# EAGLE design tardis-r2 (EAGLE 9.4.2)

## Sheet 1 of 3
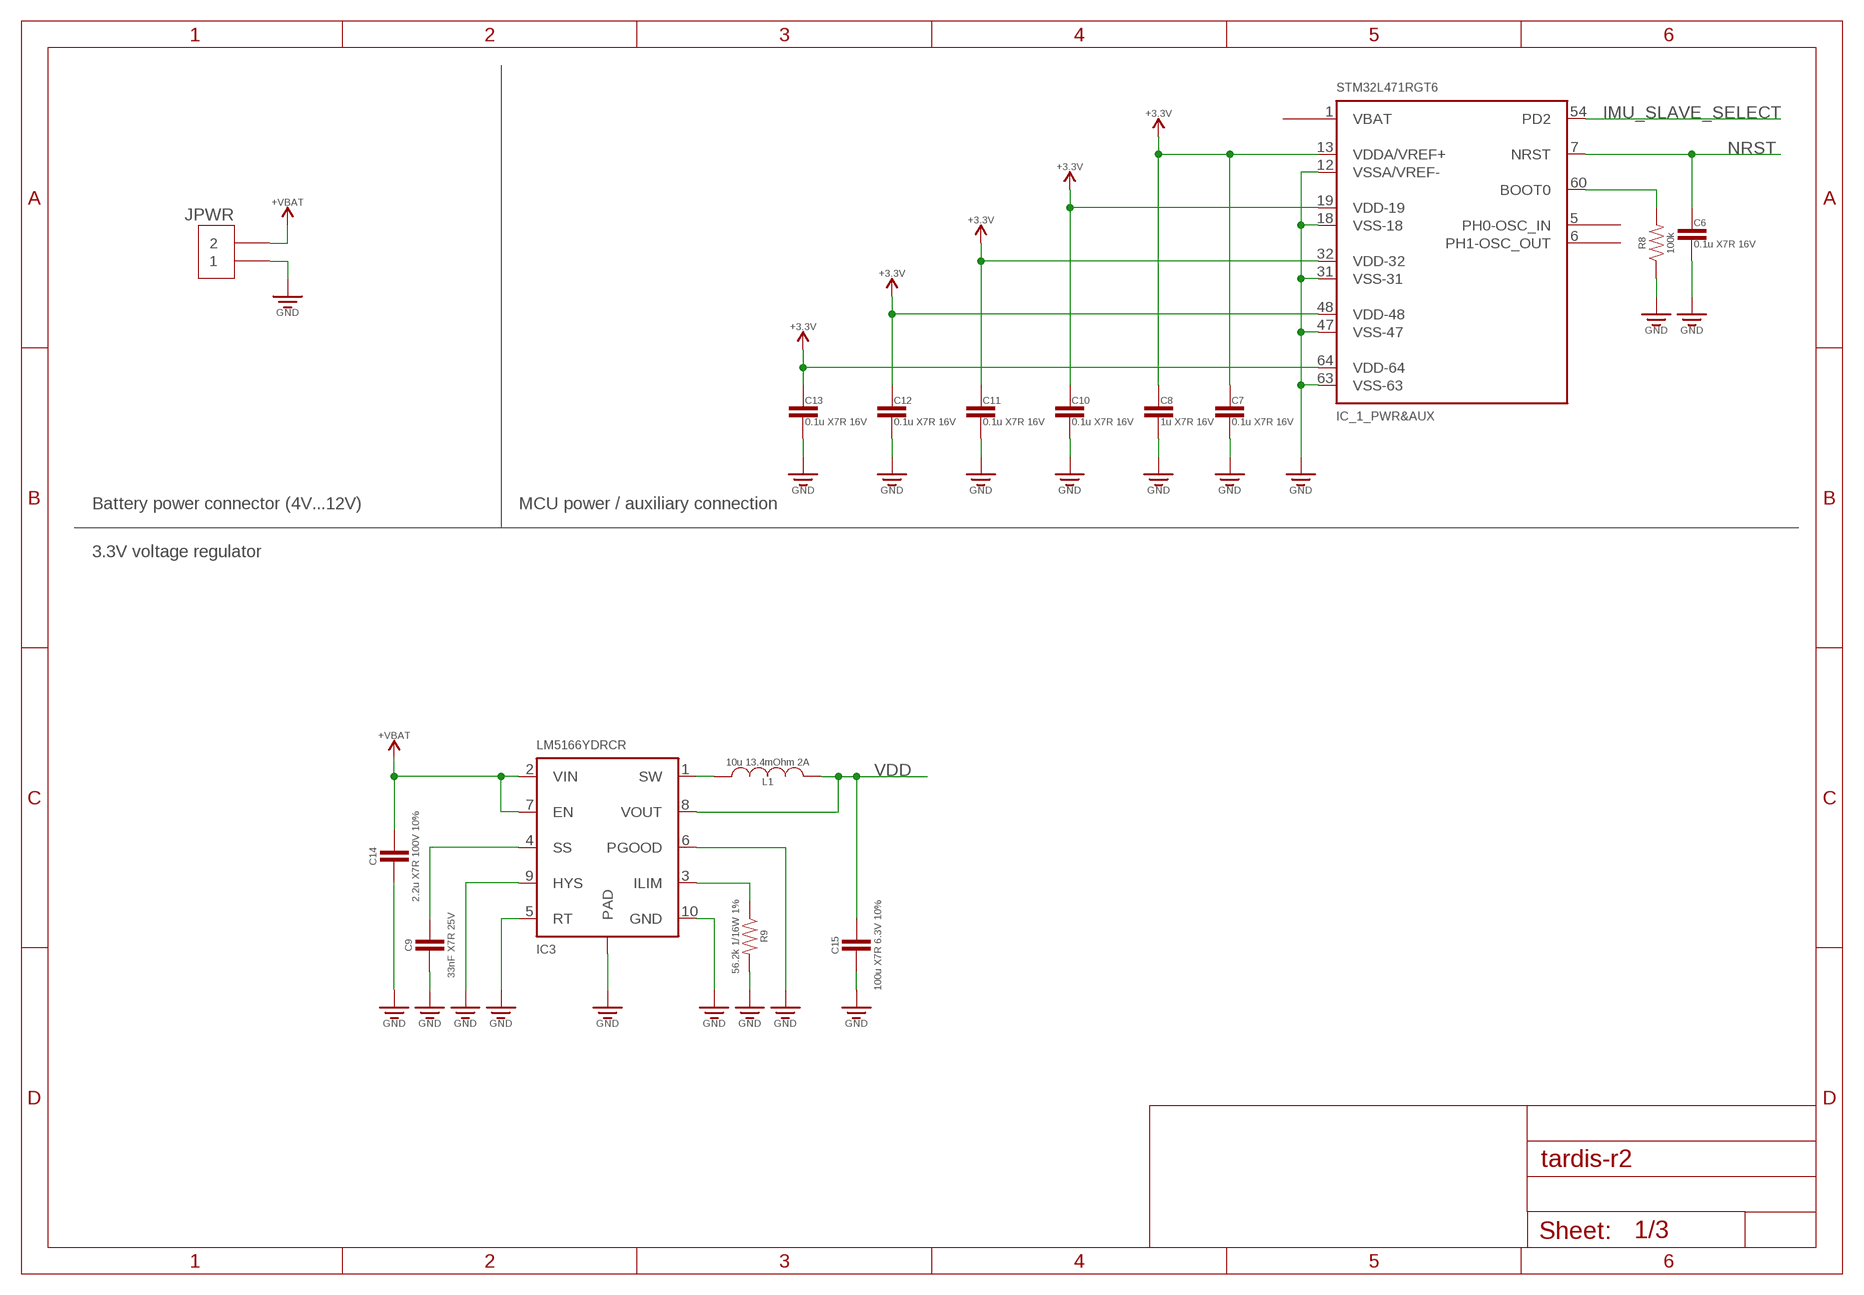
[diagram p0: schematic, sheet 1]

### Parts
C6  0.1u X7R 16V  CAPACITOR0603  [CAPACITOR-0603]
C7  0.1u X7R 16V  CAPACITOR0603  [CAPACITOR-0603]
C8  1u X7R 16V  CAPACITOR0603  [CAPACITOR-0603]
C9  33nF X7R 25V  CAPACITOR0402  [CAPACITOR-0402]
C10  0.1u X7R 16V  CAPACITOR0603  [CAPACITOR-0603]
C11  0.1u X7R 16V  CAPACITOR0603  [CAPACITOR-0603]
C12  0.1u X7R 16V  CAPACITOR0603  [CAPACITOR-0603]
C13  0.1u X7R 16V  CAPACITOR0603  [CAPACITOR-0603]
C14  2.2u X7R 100V 10%  CAPACITOR1206  [CAPACITOR-1206]
C15  100u X7R 6.3V 10%  CAPACITOR1206  [CAPACITOR-1206]
IC3  LM5166YDRCR  [VSON-10-0.5MM-PAD]
IC_1  STM32L471RGT6  [LQFP64_10X10]
JPWR  WURTH_691103110002  [WURTH_691103110002]
L1  10u 13.4mOhm 2A  INDUCTORWE-74477710  [INDUCTOR-WE-74477710]
R8  100k  RESISTOR0603  [RESISTOR-0603]
R9  56.2k 1/16W 1%  RESISTOR0402  [RESISTOR-0402]
SUPPLY9  +VBAT  (no package)
SUPPLY10  +3.3V  (no package)
SUPPLY11  +3.3V  (no package)
SUPPLY12  +3.3V  (no package)
SUPPLY13  +3.3V  (no package)
SUPPLY14  +3.3V  (no package)
SUPPLY15  +VBAT  (no package)
U$3  NC  (no package)
U$4  NC  (no package)
U$5  NC  (no package)

### Nets
BOOT0: IC_1.60(_PWR&AUX:BOOT0) R8.P$2
GND: C6.2 C7.2 C8.2 C9.P$2 C10.2 C11.2 C12.2 C13.2 C14.P$2 C15.P$2 IC3.5(RT) IC3.6(PGOOD) IC3.9(HYS) IC3.10(GND) IC3.PAD IC_1.12(_PWR&AUX:VSSA/VREF-) IC_1.18(_PWR&AUX:VSS-18) IC_1.31(_PWR&AUX:VSS-31) IC_1.47(_PWR&AUX:VSS-47) IC_1.63(_PWR&AUX:VSS-63) JPWR.1 R8.P$1 R9.P$2 ; also sheet 2
ILIM: IC3.3(ILIM) R9.P$1
IMU_SLAVE_SELECT: IC_1.54(_PWR&AUX:PD2) ; also sheet 2
NRST: C6.1 IC_1.7(_PWR&AUX:NRST) ; also sheet 2
SS: C9.P$1 IC3.4(SS)
SW: IC3.1(SW) L1.P$1
VBAT: C14.P$1 IC3.2(VIN) IC3.7(EN) JPWR.2 SUPPLY9.VCC SUPPLY15.VCC
VDD: C7.1 C8.1 C10.1 C11.1 C12.1 C13.1 C15.P$1 IC3.8(VOUT) IC_1.13(_PWR&AUX:VDDA/VREF+) IC_1.19(_PWR&AUX:VDD-19) IC_1.32(_PWR&AUX:VDD-32) IC_1.48(_PWR&AUX:VDD-48) IC_1.64(_PWR&AUX:VDD-64) L1.P$2 SUPPLY10.VCC SUPPLY11.VCC SUPPLY12.VCC SUPPLY13.VCC SUPPLY14.VCC ; also sheet 2
Unconnected: IC_1.1(_PWR&AUX:VBAT) IC_1.5(_PWR&AUX:PH0-OSC_IN) IC_1.6(_PWR&AUX:PH1-OSC_OUT) U$3.1 U$4.1 U$5.1

### Notes on the sheet
- Battery power connector (4V...12V) | MCU power / auxiliary connection
- 3.3V voltage regulator

## Sheet 2 of 3
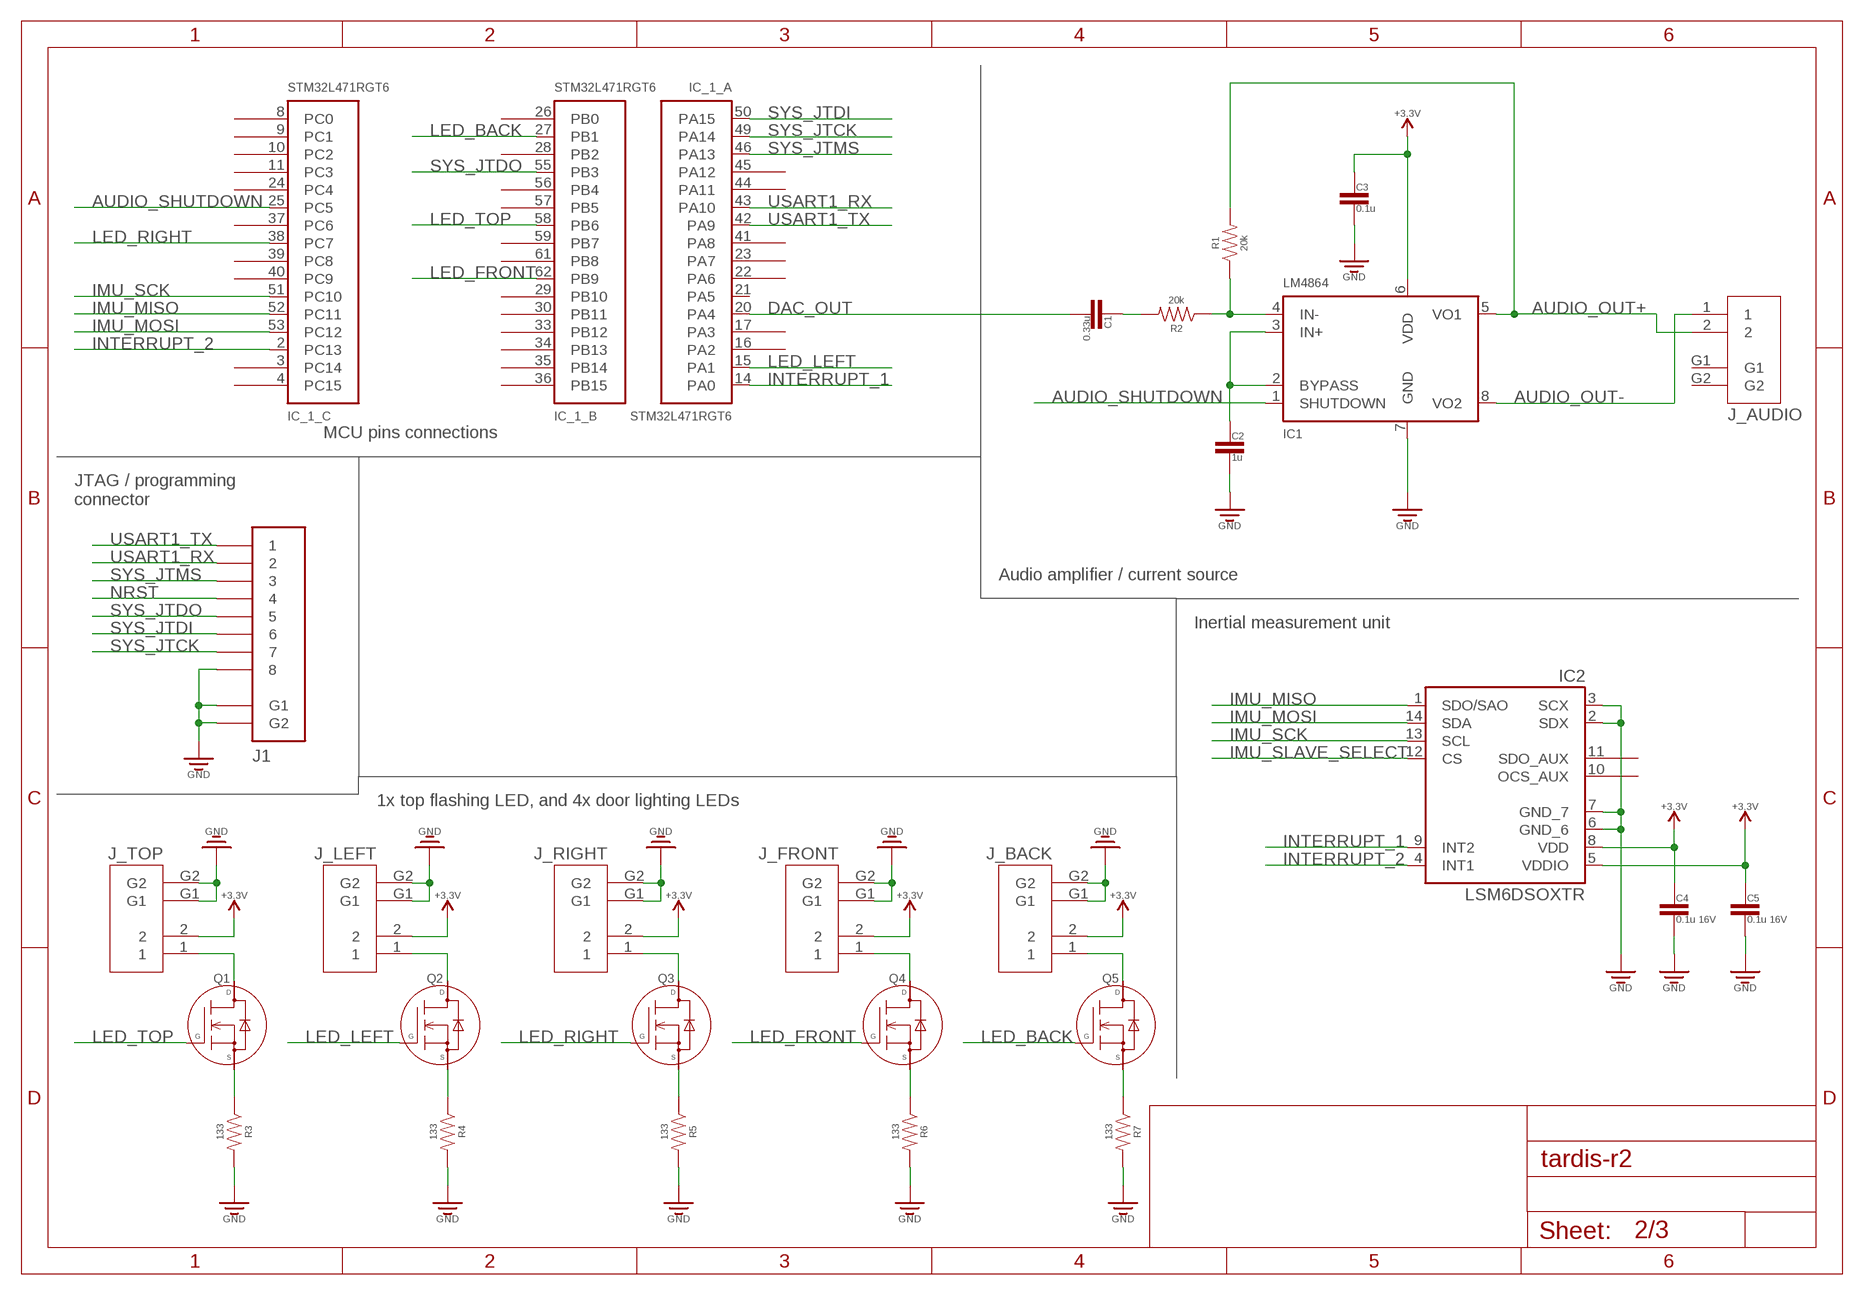
[diagram p1: schematic, sheet 2]

### Parts
C1  0.33u  CAPACITOR0805  [CAPACITOR-0805]
C2  1u  CAPACITOR0805  [CAPACITOR-0805]
C3  0.1u  CAPACITOR0805  [CAPACITOR-0805]
C4  0.1u 16V  CAPACITOR0603  [CAPACITOR-0603]
C5  0.1u 16V  CAPACITOR0603  [CAPACITOR-0603]
IC1  LM4864  [SOIC-8]
IC2  LSM6DSOXTR  [LGA-14L]
J1  MOLEX-53261-0871  [MOLEX-53261-0871]
J_AUDIO  MOLEX-502382-02XX  [MOLEX-502382-02XX]
J_BACK  MOLEX-502382-02XX  [MOLEX-502382-02XX]
J_FRONT  MOLEX-502382-02XX  [MOLEX-502382-02XX]
J_LEFT  MOLEX-502382-02XX  [MOLEX-502382-02XX]
J_RIGHT  MOLEX-502382-02XX  [MOLEX-502382-02XX]
J_TOP  MOLEX-502382-02XX  [MOLEX-502382-02XX]
Q1  2N7002  [SOT-23]
Q2  2N7002  [SOT-23]
Q3  2N7002  [SOT-23]
Q4  2N7002  [SOT-23]
Q5  2N7002  [SOT-23]
R1  20k  RESISTOR0805  [RESISTOR-0805]
R2  20k  RESISTOR0805  [RESISTOR-0805]
R3  133  RESISTOR0805  [RESISTOR-0805]
R4  133  RESISTOR0805  [RESISTOR-0805]
R5  133  RESISTOR0805  [RESISTOR-0805]
R6  133  RESISTOR0805  [RESISTOR-0805]
R7  133  RESISTOR0805  [RESISTOR-0805]
SUPPLY1  +3.3V  (no package)
SUPPLY2  +3.3V  (no package)
SUPPLY3  +3.3V  (no package)
SUPPLY4  +3.3V  (no package)
SUPPLY5  +3.3V  (no package)
SUPPLY6  +3.3V  (no package)
SUPPLY7  +3.3V  (no package)
SUPPLY8  +3.3V  (no package)
U$1  NC  (no package)
U$2  NC  (no package)
U$6  NC  (no package)
U$7  NC  (no package)
U$8  NC  (no package)
U$9  NC  (no package)
U$10  NC  (no package)
U$11  NC  (no package)
U$12  NC  (no package)
U$13  NC  (no package)
U$14  NC  (no package)
U$15  NC  (no package)
U$16  NC  (no package)
U$17  NC  (no package)
U$18  NC  (no package)
U$19  NC  (no package)
U$20  NC  (no package)
U$21  NC  (no package)
U$22  NC  (no package)
U$23  NC  (no package)
U$24  NC  (no package)
U$25  NC  (no package)
U$26  NC  (no package)
U$27  NC  (no package)
U$28  NC  (no package)
U$29  NC  (no package)
U$30  NC  (no package)
U$31  NC  (no package)
U$32  NC  (no package)
U$33  NC  (no package)
U$34  NC  (no package)

### Nets
AUDIO_OUT+: IC1.5(VO1) J_AUDIO.2 R1.2
AUDIO_OUT-: IC1.8(VO2) J_AUDIO.1
AUDIO_SHUTDOWN: IC1.1(SHUTDOWN) IC_1.25(_C:PC5)
DAC_OUT: C1.2 IC_1.20(_A:PA4)
GND: C2.2 C3.2 C4.2 C5.2 IC1.7(GND) IC2.2(SDX) IC2.3(SCX) IC2.6(GND_6) IC2.7(GND_7) J1.8 J1.G1 J1.G2 J_BACK.G1 J_BACK.G2 J_FRONT.G1 J_FRONT.G2 J_LEFT.G1 J_LEFT.G2 J_RIGHT.G1 J_RIGHT.G2 J_TOP.G1 J_TOP.G2 R3.2 R4.2 R5.2 R6.2 R7.2 ; also sheet 1
IMU_MISO: IC2.1(SDO/SAO) IC_1.52(_C:PC11)
IMU_MOSI: IC2.14(SDA) IC_1.53(_C:PC12)
IMU_SCK: IC2.13(SCL) IC_1.51(_C:PC10)
IMU_SLAVE_SELECT: IC2.12(CS) ; also sheet 1
INTERRUPT_1: IC2.9(INT2) IC_1.14(_A:PA0)
INTERRUPT_2: IC2.4(INT1) IC_1.2(_C:PC13)
LED_BACK: IC_1.27(_B:PB1) Q5.P$2(GATE)
LED_FRONT: IC_1.62(_B:PB9) Q4.P$2(GATE)
LED_LEFT: IC_1.15(_A:PA1) Q2.P$2(GATE)
LED_RIGHT: IC_1.38(_C:PC7) Q3.P$2(GATE)
LED_TOP: IC_1.58(_B:PB6) Q1.P$2(GATE)
N$2: C2.1 IC1.2(BYPASS) IC1.3(IN+)
N$3: Q1.P$3(SOURCE) R3.1
N$4: IC1.4(IN-) R1.1 R2.1
N$5: C1.1 R2.2
N$6: J_TOP.1 Q1.P$1(DRAIN)
N$7: Q2.P$3(SOURCE) R4.1
N$8: J_LEFT.1 Q2.P$1(DRAIN)
N$10: Q3.P$3(SOURCE) R5.1
N$11: J_RIGHT.1 Q3.P$1(DRAIN)
N$13: Q4.P$3(SOURCE) R6.1
N$14: J_FRONT.1 Q4.P$1(DRAIN)
N$16: Q5.P$3(SOURCE) R7.1
N$17: J_BACK.1 Q5.P$1(DRAIN)
NRST: J1.4 ; also sheet 1
SYS_JTCK: IC_1.49(_A:PA14) J1.7
SYS_JTDI: IC_1.50(_A:PA15) J1.6
SYS_JTDO: IC_1.55(_B:PB3) J1.5
SYS_JTMS: IC_1.46(_A:PA13) J1.3
USART1_RX: IC_1.43(_A:PA10) J1.2
USART1_TX: IC_1.42(_A:PA9) J1.1
VDD: C3.1 C4.1 C5.1 IC1.6(VDD) IC2.5(VDDIO) IC2.8(VDD) J_BACK.2 J_FRONT.2 J_LEFT.2 J_RIGHT.2 J_TOP.2 SUPPLY1.VCC SUPPLY2.VCC SUPPLY3.VCC SUPPLY4.VCC SUPPLY5.VCC SUPPLY6.VCC SUPPLY7.VCC SUPPLY8.VCC ; also sheet 1
Unconnected: IC2.10(OCS_AUX) IC2.11(SDO_AUX) IC_1.3(_C:PC14) IC_1.4(_C:PC15) IC_1.8(_C:PC0) IC_1.9(_C:PC1) IC_1.10(_C:PC2) IC_1.11(_C:PC3) IC_1.16(_A:PA2) IC_1.17(_A:PA3) IC_1.21(_A:PA5) IC_1.22(_A:PA6) IC_1.23(_A:PA7) IC_1.24(_C:PC4) IC_1.26(_B:PB0) IC_1.28(_B:PB2) IC_1.29(_B:PB10) IC_1.30(_B:PB11) IC_1.33(_B:PB12) IC_1.34(_B:PB13) IC_1.35(_B:PB14) IC_1.36(_B:PB15) IC_1.37(_C:PC6) IC_1.39(_C:PC8) IC_1.40(_C:PC9) IC_1.41(_A:PA8) IC_1.44(_A:PA11) IC_1.45(_A:PA12) IC_1.56(_B:PB4) IC_1.57(_B:PB5) IC_1.59(_B:PB7) IC_1.61(_B:PB8) J_AUDIO.G1 J_AUDIO.G2 U$1.1 U$2.1 U$6.1 U$7.1 U$8.1 U$9.1 U$10.1 U$11.1 U$12.1 U$13.1 U$14.1 U$15.1 U$16.1 U$17.1 U$18.1 U$19.1 U$20.1 U$21.1 U$22.1 U$23.1 U$24.1 U$25.1 U$26.1 U$27.1 U$28.1 U$29.1 U$30.1 U$31.1 U$32.1 U$33.1 U$34.1

### Notes on the sheet
- MCU pins connections
- JTAG / programming
  connector
- Audio amplifier / current source
- Inertial measurement unit
- 1x top flashing LED, and 4x door lighting LEDs

## Sheet 3 of 3
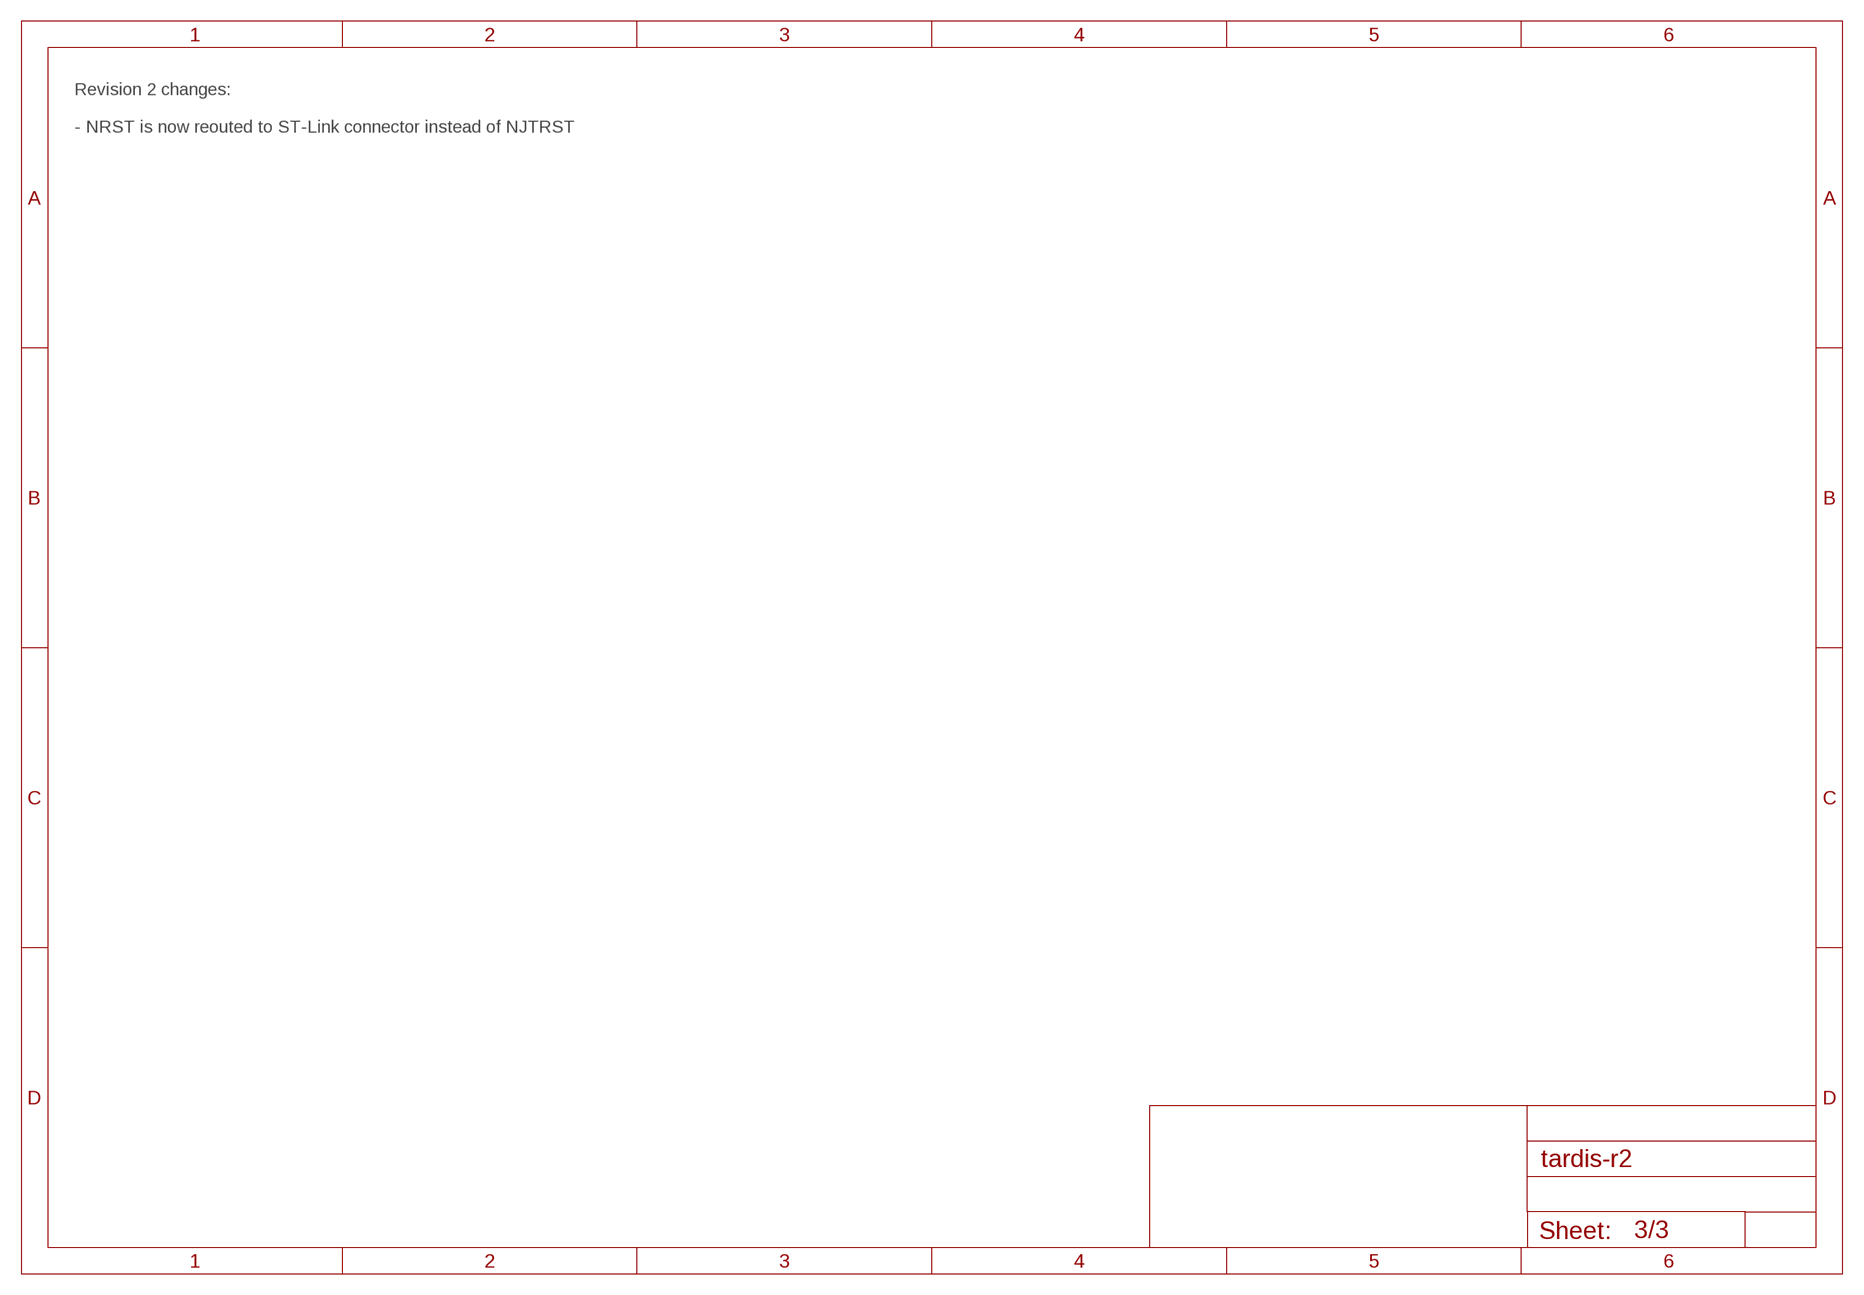
[diagram p2: schematic, sheet 3]

### Notes on the sheet
- Revision 2 changes:
  
  - NRST is now reouted to ST-Link connector instead of NJTRST

## Library data of the parts
C1-C15 = passives:CAPACITOR
IC1 = amp:LM4864
IC2 = sensors:LSM6DSOXTR
IC3 = voltage-regulator:LM5166YDRCR
IC_1 = mcu:STM32L471RGT6
J1 = connectors:MOLEX-53261-0871
J_AUDIO J_BACK J_FRONT J_LEFT J_RIGHT J_TOP = connectors:MOLEX-502382-02XX
JPWR = connectors:WURTH_691103110002
L1 = passives:INDUCTOR
Q1-Q5 = passives:2N7002
R1-R9 = passives:RESISTOR
SUPPLY1-SUPPLY8 SUPPLY10-SUPPLY14 = voltage-ground:+3.3V: +3.3V Voltage Supply Positive voltage supply (traditionally for a BJT device, C=collector).
SUPPLY9 SUPPLY15 = voltage-ground:+VBAT: +3.3V Voltage Supply Positive voltage supply (traditionally for a BJT device, C=collector).
U$1-U$34 = voltage-ground:NC

## Board
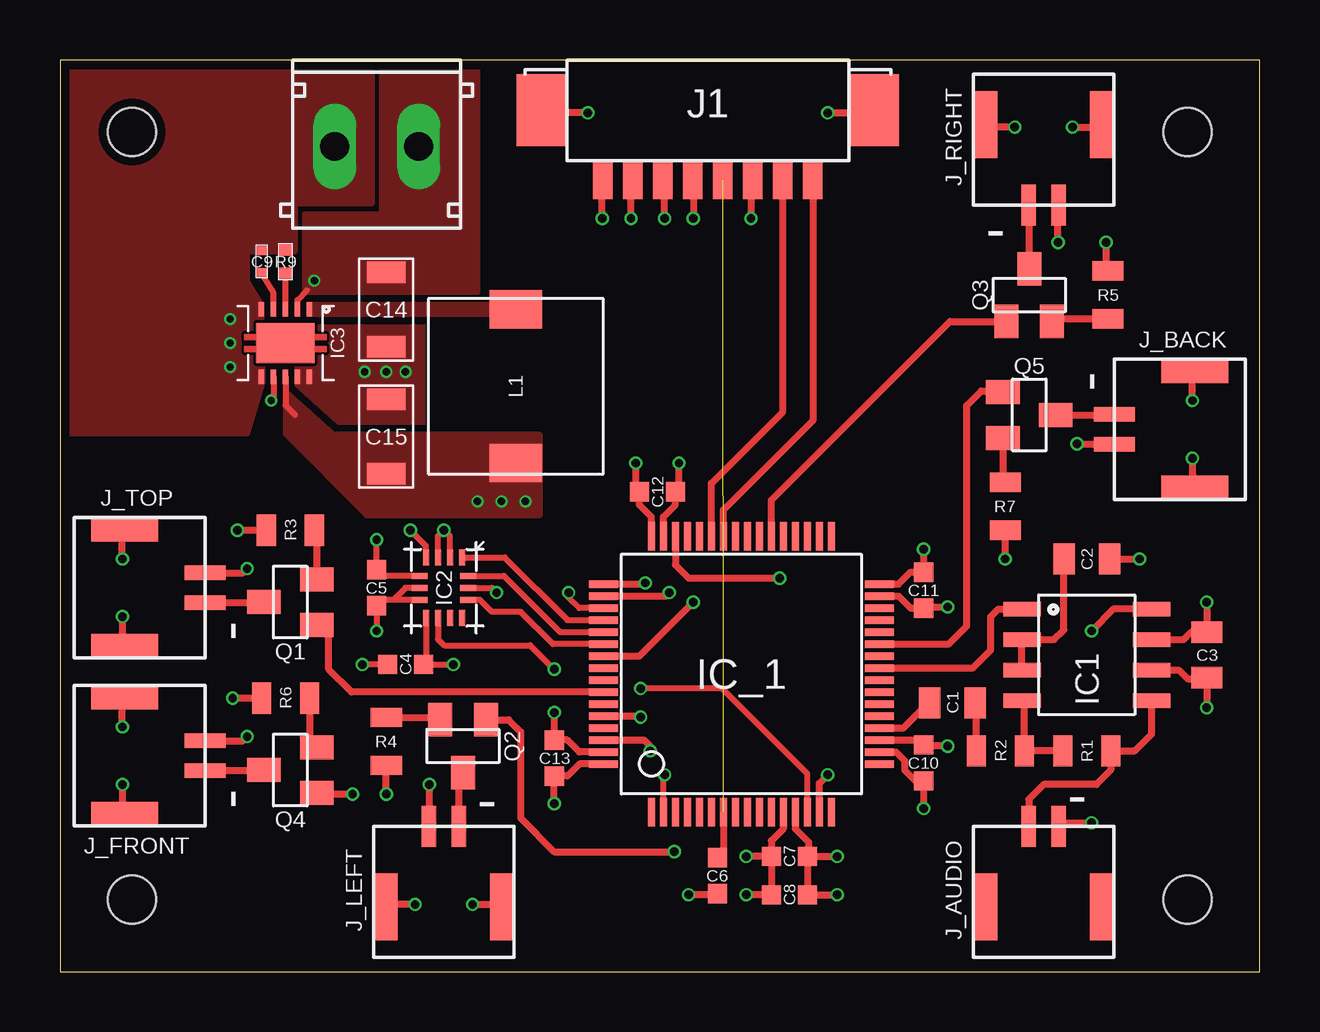
[diagram p3: board, top side]
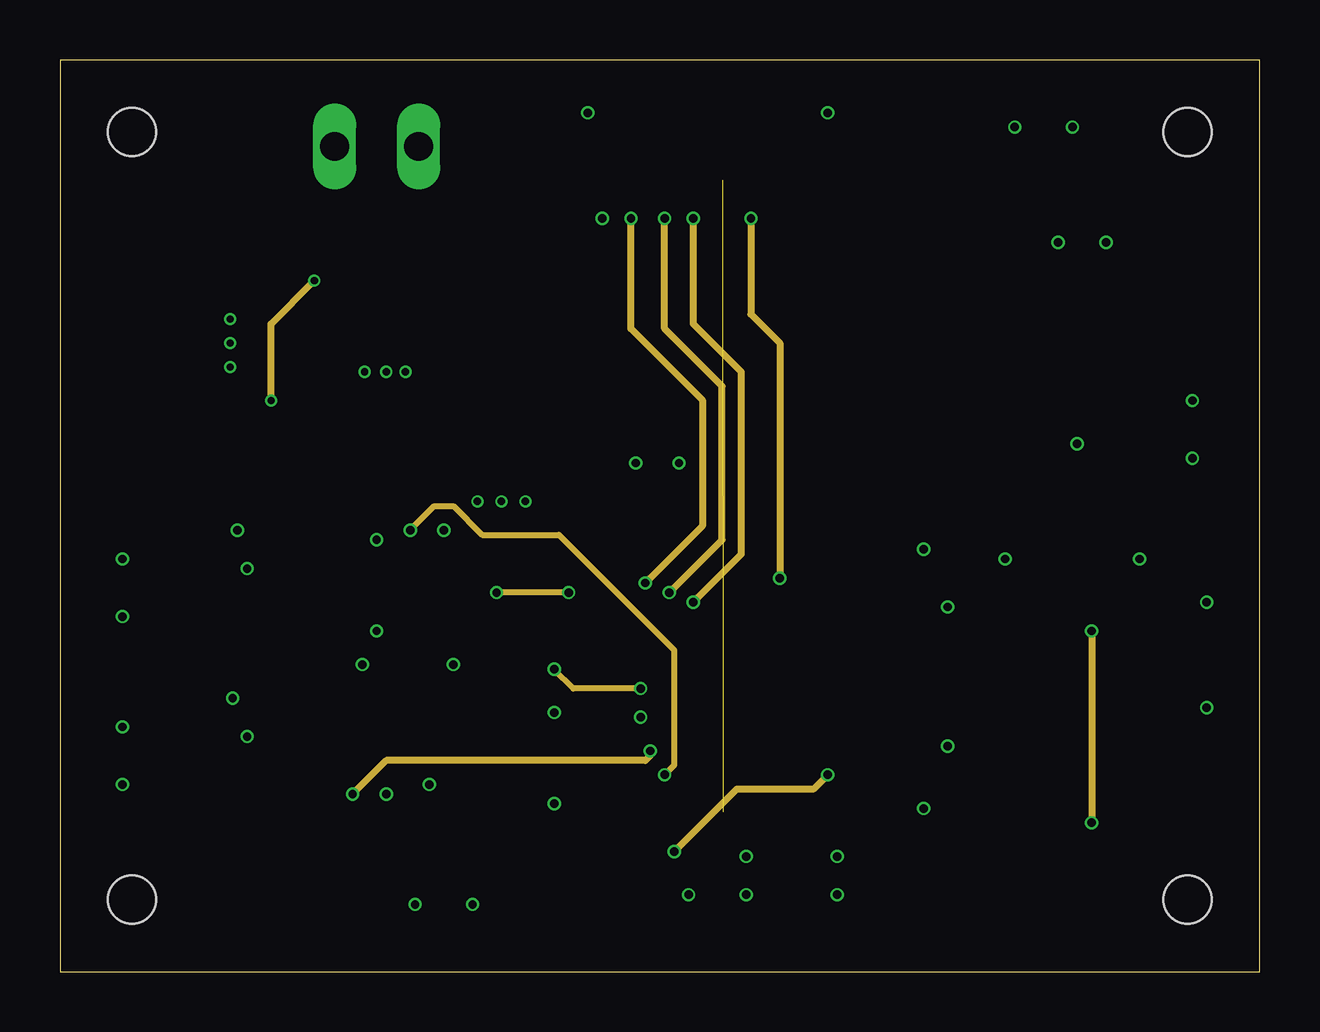
[diagram p4: board, inner layer Route2]
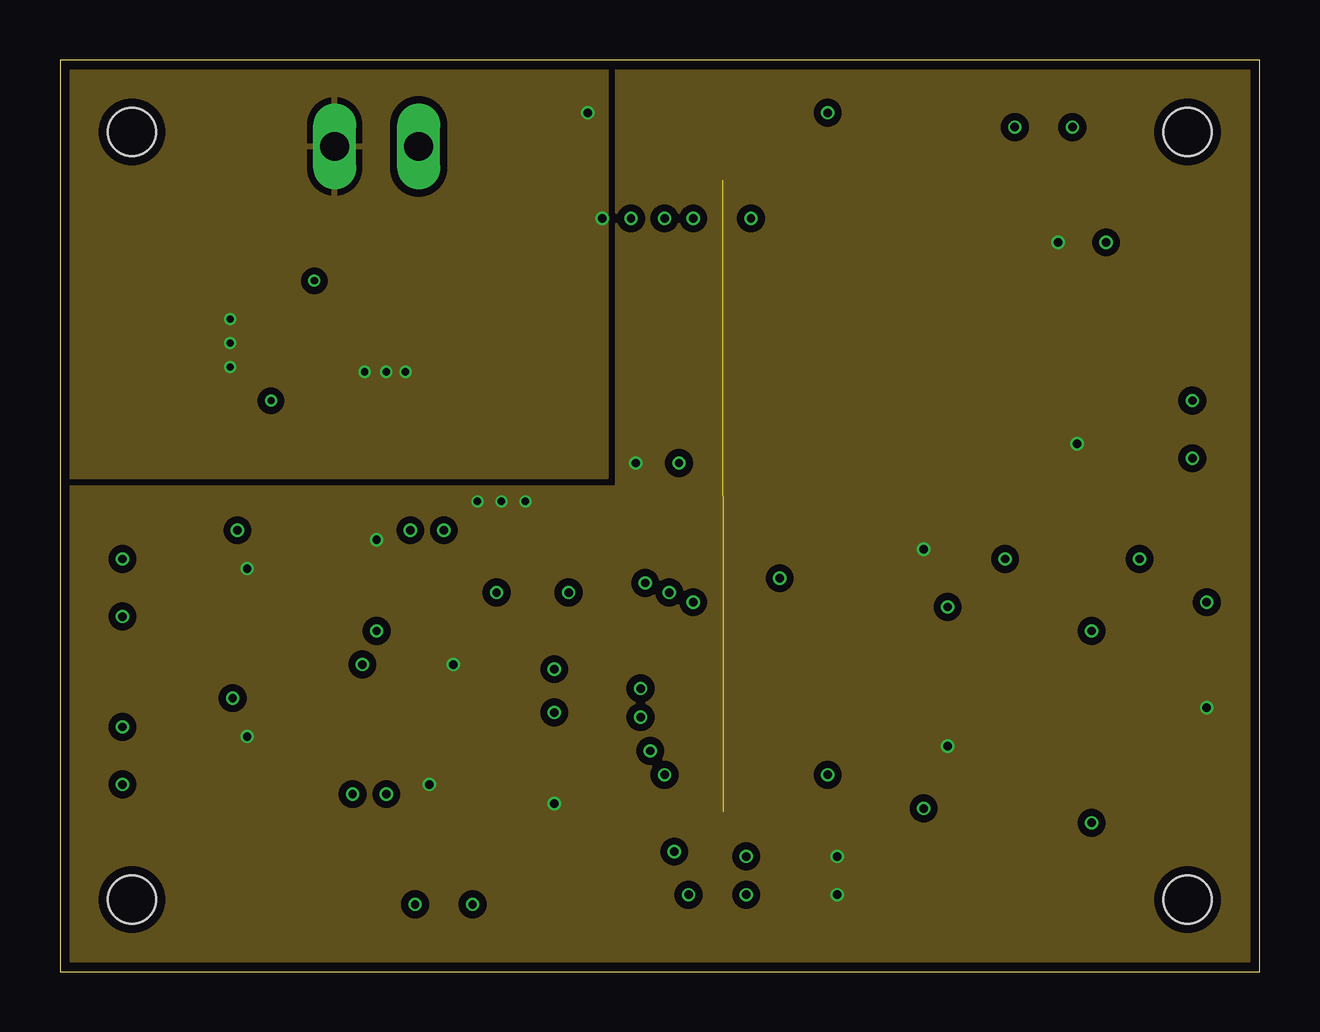
[diagram p5: board, inner layer Route15]
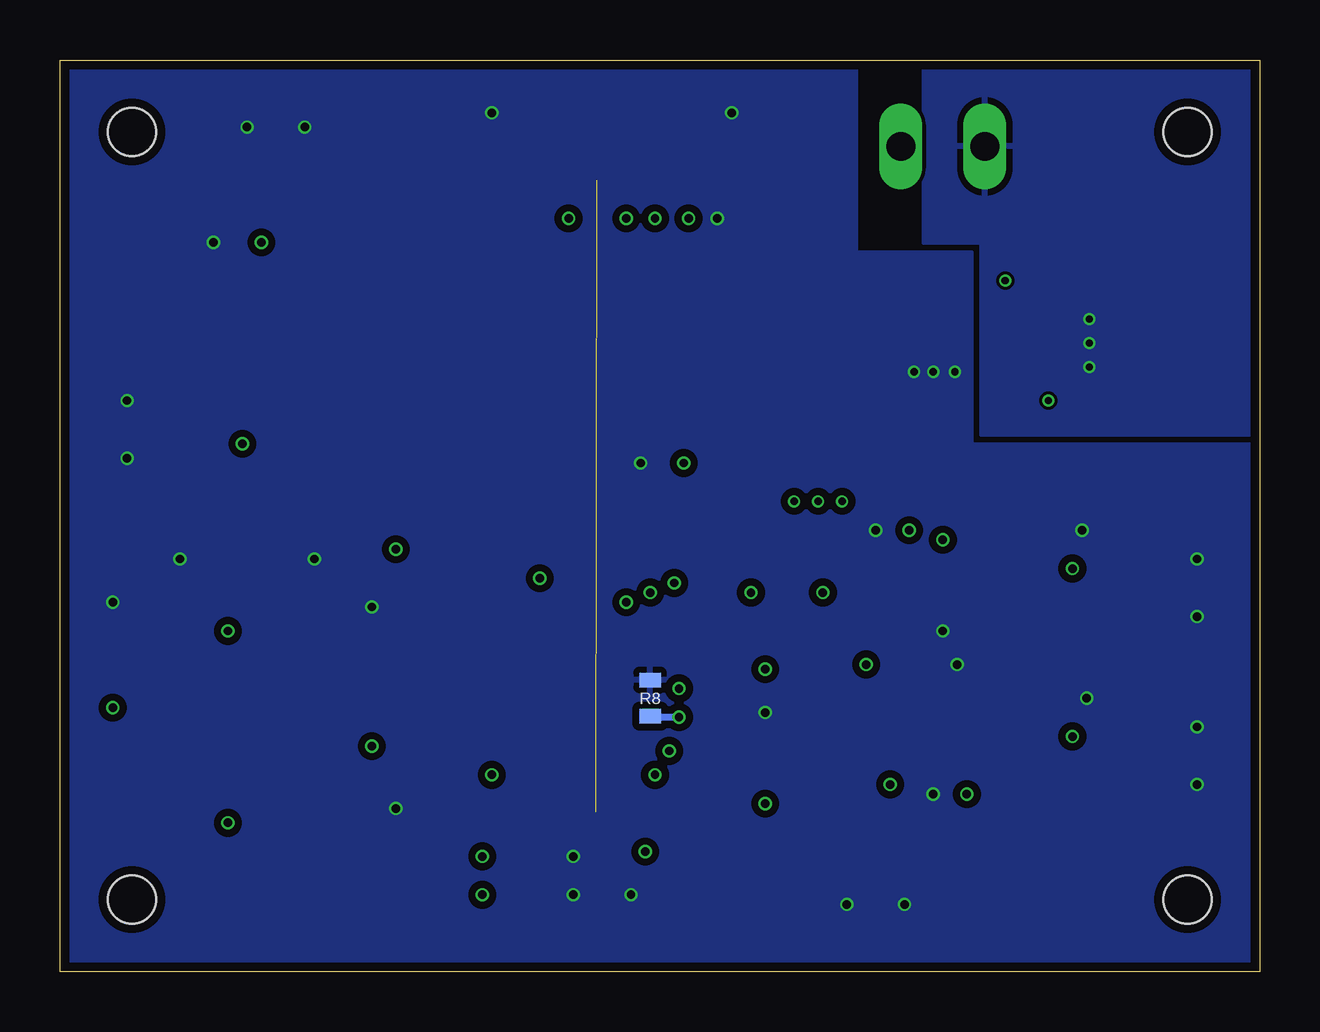
[diagram p6: board, bottom side, seen from below]

Size 50 x 38 mm. Coordinates in mm from the lower left corner, seen from the top.
Outline: 0,0 50,0 50,38 0,38 0,0
Copper layers (1*2*15*16): Top 0.035559375mm / dielectric 0.17018125mm / Route2 0.01778125mm / dielectric 47mil / Route15 0.01778125mm / dielectric 0.17018125mm / Bottom 0.035559375mm
Design rules "oshpark-4layer": minimum track width 5mil, minimum drill 10mil, track to track 5mil, track to pad 5mil, pad to pad 5mil, via to via 5mil, smd to smd 5mil, copper to edge 15mil, drill to drill 6mil, minimum pad ring 4mil, minimum via ring 4mil, stop-mask expansion 2.5mil, vias tented up to drill 0mil, thermal gap 10mil
Holes 2 mm at 47,35 3,35 47,3 3,3

### Footprints (pad centres in the part's own frame; a part is rotated, then mirrored left to right if it is on the bottom)
CAPACITOR-0805 = smd 0.9 x 1.3: 1 -0.95,0; 2 0.95,0
CAPACITOR-0603 = smd 0.8 x 0.8: 1 -0.75,0; 2 0.75,0
CAPACITOR-0402 = smd 0.4 x 0.5: P$1 -0.475,0; P$2 0.475,0
CAPACITOR-1206 = smd 0.9 x 1.6: P$1 -1.55,0; P$2 1.55,0
SOIC-8 = smd 0.6 x 1.55: 1 -1.905,-2.7; 2 -0.635,-2.7; 3 0.635,-2.7; 4 1.905,-2.7; 5 1.905,2.7; 6 0.635,2.7; 7 -0.635,2.7; 8 -1.905,2.7
LGA-14L = smd 0.675 x 0.25: 1 -1.262,0.75; 2 -1.262,0.25; 3 -1.262,-0.25; 4 -1.262,-0.75; 8 1.262,-0.75; 9 1.262,-0.25; 10 1.262,0.25; 11 1.262,0.75 | smd 0.25 x 0.675: 5 -0.5,-1.012; 6 0,-1.012; 7 0.5,-1.012; 12 0.5,1.012; 13 0,1.012; 14 -0.5,1.012
VSON-10-0.5MM-PAD = smd 0.6 x 0.24: 1 -1.4,1; 2 -1.4,0.5; 3 -1.4,0; 4 -1.4,-0.5; 5 -1.4,-1; 6 1.4,-1; 7 1.4,-0.5; 8 1.4,0; 9 1.4,0.5; 10 1.4,1 | smd 1.65 x 2.4: PAD 0,0
LQFP64_10X10 = smd 0.3 x 1.2: 1 -3.75,-5.75; 2 -3.25,-5.75; 3 -2.75,-5.75; 4 -2.25,-5.75; 5 -1.75,-5.75; 6 -1.25,-5.75; 7 -0.75,-5.75; 8 -0.25,-5.75; 9 0.25,-5.75; 10 0.75,-5.75; 11 1.25,-5.75; 12 1.75,-5.75; 13 2.25,-5.75; 14 2.75,-5.75; 15 3.25,-5.75; 16 3.75,-5.75; 33 3.75,5.75; 34 3.25,5.75; 35 2.75,5.75; 36 2.25,5.75; 37 1.75,5.75; 38 1.25,5.75; 39 0.75,5.75; 40 0.25,5.75; 41 -0.25,5.75; 42 -0.75,5.75; 43 -1.25,5.75; 44 -1.75,5.75; 45 -2.25,5.75; 46 -2.75,5.75; 47 -3.25,5.75; 48 -3.75,5.75 | smd 1.2 x 0.3: 17 5.75,-3.75; 18 5.75,-3.25; 19 5.75,-2.75; 20 5.75,-2.25; 21 5.75,-1.75; 22 5.75,-1.25; 23 5.75,-0.75; 24 5.75,-0.25; 25 5.75,0.25; 26 5.75,0.75; 27 5.75,1.25; 28 5.75,1.75; 29 5.75,2.25; 30 5.75,2.75; 31 5.75,3.25; 32 5.75,3.75; 49 -5.75,3.75; 50 -5.75,3.25; 51 -5.75,2.75; 52 -5.75,2.25; 53 -5.75,1.75; 54 -5.75,1.25; 55 -5.75,0.75; 56 -5.75,0.25; 57 -5.75,-0.25; 58 -5.75,-0.75; 59 -5.75,-1.25; 60 -5.75,-1.75; 61 -5.75,-2.25; 62 -5.75,-2.75; 63 -5.75,-3.25; 64 -5.75,-3.75
MOLEX-53261-0871 = smd 0.8 x 1.6: 1 -4.375,5; 2 -3.125,5; 3 -1.875,5; 4 -0.625,5; 5 0.625,5; 6 1.875,5; 7 3.125,5; 8 4.375,5 | smd 2.1 x 3: G1 -6.925,2.1; G2 6.925,2.1
MOLEX-502382-02XX = smd 0.6 x 1.7: 1 -0.625,-5.45; 2 0.625,-5.45 | smd 1 x 2.8: G1 -2.425,-2.1; G2 2.425,-2.1
WURTH_691103110002 = drill 1.2 long: 1 -1.75,-3.6; 2 1.75,-3.6
INDUCTOR-WE-74477710 = smd 2.2 x 1.6: P$1 0,3.2; P$2 0,-3.2
SOT-23 = smd 1 x 1.4: P$1 0,1.1; P$2 -0.95,-1.1; P$3 0.95,-1.1
RESISTOR-0805 = smd 0.8 x 1.3: 1 -1,0; 2 1,0
RESISTOR-0603 = smd 0.6 x 0.9: P$1 -0.75,0; P$2 0.75,0
RESISTOR-0402 = smd 0.5 x 0.6: P$1 -0.5,0; P$2 0.5,0

### Placement (x,y rotation side)
C1  37.2,11.2 180 top
C2  42.8,17.2 0 top
C3  47.8,13.2 90 top
C4  14.4,12.8 180 top
C5  13.2,16 270 top
C6  27.4,4 270 top
C7  30.4,4.8 180 top
C8  30.4,3.2 180 top
C9  8.4,29.6 90 top
C10  36,8.7 270 top
C11  36,15.9 270 top
C12  24.9,20 0 top
C13  20.6,8.9 90 top
C14  13.6,27.6 270 top
C15  13.6,22.3 90 top
IC1  42.8,13.2 270 top
IC2  16,16 270 top
IC3  9.4,26.2 270 top
IC_1  28.4,12.4 0 top
J1  27,38 180 top
J_AUDIO  41,0.6 180 top
J_BACK  49.4,22.6 270 top
J_FRONT  0.6,9 90 top
J_LEFT  16,0.6 180 top
J_RIGHT  41,37.4 0 top
J_TOP  0.6,16 90 top
JPWR  13.2,38 0 top
L1  19,24.4 0 top
Q1  9.6,15.4 90 top
Q2  16.8,9.4 180 top
Q3  40.4,28.2 0 top
Q4  9.6,8.4 90 top
Q5  40.4,23.2 270 top
R1  42.8,9.2 0 top
R2  39.2,9.2 180 top
R3  9.6,18.4 180 top
R4  13.6,9.6 270 top
R5  43.68,28.21 90 top
R6  9.4,11.4 180 top
R7  39.4,19.4 270 top
R8  25.4,11.4 270 bottom
R9  9.4,29.6 90 top

### Tracks (layer width: path | path; a pad name or v marks a point on that pad's centre or on a via)
AUDIO_OUT+
  Top 0.3: J_AUDIO.2 40.38,7.17 41,7.8 43.2,7.8 43.8,8.4 R1.2 44.8,9.2 45.5,9.9 IC1.5
AUDIO_OUT-  (via drill 0.35)
  Top 0.3: IC1.8 43.91,15.11 v43,14.2 | J_AUDIO.1 41.77,6.2 v43,6.2
  Route2 0.3: v43,14.2 v43,6.2
AUDIO_SHUTDOWN
  Top 0.3: IC_1.25 38.05,12.65 38.8,13.4 38.8,14.8 39.1,15.11 IC1.1
BOOT0  (via drill 0.35)
  Top 0.3: IC_1.60 24.15,10.65 v24.2,10.6
  Bottom 0.3: v24.2,10.6 25.35,10.6 R8.P$2
DAC_OUT
  Top 0.3: IC_1.20 35.15,10.15 36.2,11.2 C1.2
GND  (via drill 0.3, 0.35)
  Top 0.24: IC2.7 14,15.5 | 14,15.5 13.45,15.5 C5.2 v13.2,14.2 | IC2.6 14.4,16 14,15.6 14,15.5 | C4.2 v12.6,12.8 | IC2.2 16.25,18.15 v16,18.4 15.75,18.15 IC2.3
  Top 0.3: IC_1.12 30.15,5.95 29.65,5.45 C7.2 | C7.2 C8.2 v28.6,3.2 | C7.2 v28.6,4.8 | IC_1.18 34.85,9.15 35.2,8.8 35.2,8.4 35.65,7.95 C10.2 v36,6.8 | IC_1.31 34.95,15.65 35.45,15.15 C11.2 36.05,15.2 v37,15.2 | IC1.7 46.84,13.84 47.15,14.15 C3.2 v47.8,15.4 | C2.2 v45,17.2 | v39.4,17.2 R7.2 | v47.2,23.8 47.2,24.93 J_BACK.G1 | v47.2,21.4 47.2,20.27 J_BACK.G2 | v43.6,30.4 43.6,29.29 R5.2 | v39.8,35.2 38.67,35.2 J_RIGHT.G1 | v42.2,35.2 43.33,35.2 J_RIGHT.G2 | IC_1.47 25.15,18.95 25.65,19.45 C12.2 25.8,20.15 v25.8,21.2 | v22.6,31.4 22.6,32.98 J1.8 | v22,35.8 20.18,35.8 J1.G2 | v32,35.8 33.83,35.8 J1.G1 | v20.6,10.8 C13.2 21.15,9.65 21.65,9.15 IC_1.63 | v14.8,2.8 13.68,2.8 J_LEFT.G2 | v17.2,2.8 18.32,2.8 J_LEFT.G1 | v13.6,7.4 R4.2 | v2.6,10.2 2.6,11.32 J_FRONT.G2 | v2.6,7.8 2.6,6.67 J_FRONT.G1 | v7.2,11.4 R6.2 | v2.6,17.2 2.6,18.32 J_TOP.G2 | v2.6,14.8 2.6,13.68 J_TOP.G1 | v7.4,18.4 R3.2 | C6.2 27.35,3.2 v26.2,3.2
  other vias: 12.7,25 13.6,25 14.4,25 7.1,27.2 7.1,26.2 7.1,25.2
  pour Bottom (isolate 0.3): 12,30 16.8,30 16.8,37.6 49.6,37.6 49.6,0.4 0.4,0.4 0.4,22 12,22
  pour Top (no thermals): 9.82,27 15.2,26.98 15.2,22.8 11.6,22.8 9.8,24.4
  pour Bottom: 0.4,37.6 14,37.6 14,30.4 11.6,30.4 11.6,22.4 0.4,22.4
  pour Top (no thermals): 8.4,27.8 8.44,24.56 7.8,22.4 0.4,22.4 0.4,37.6 13,37.6 13,32 9.8,32 9.8,30 7.8,30 7.8,28.8
  pour Route15 (isolate 0.3): 0.4,37.6 0.4,20.6 22.8,20.6 22.8,37.6
ILIM
  Top 0.24: IC3.3 R9.P$1
IMU_MISO
  Top 0.24: IC2.1 18.54,17.26 21.15,14.65 IC_1.52
IMU_MOSI
  Top 0.24: IC_1.53 20.85,14.15 18.5,16.5 IC2.14
IMU_SCK  (via drill 0.35)
  Top 0.24: IC_1.51 21.65,15.15 21.2,15.6 v21.2,15.8 | IC2.13 18,16 v18.2,15.8
  Route2 0.24: v21.2,15.8 v18.2,15.8
IMU_SLAVE_SELECT
  Top 0.24: IC_1.54 20.55,13.65 19.2,15 18,15 17.5,15.5 IC2.12
INTERRUPT_1  (via drill 0.35)
  Top 0.24: IC2.9 15.75,13.85 16,13.6 19.6,13.6 v20.6,12.6 | IC_1.14 31.15,8.25 27.6,11.8 v24.2,11.8
  Route2 0.24: v24.2,11.8 21.4,11.8 v20.6,12.6
INTERRUPT_2  (via drill 0.35)
  Top 0.24: IC2.4 15.25,17.75 v14.6,18.4 | IC_1.2 25.15,8.15 v25.2,8.2
  Route2 0.24: v14.6,18.4 15.6,19.4 16.4,19.4 17.6,18.2 20.8,18.2 25.6,13.4 25.6,8.6 v25.2,8.2
LED_BACK
  Top 0.3: IC_1.27 37.05,13.65 37.8,14.4 37.8,23.6 38.4,24.2 39.25,24.2 Q5.P$2
LED_FRONT  (via drill 0.35)
  Top 0.3: IC_1.62 24.35,9.65 24.6,9.4 v24.6,9.2 | Q4.P$2 10.75,7.4 v12.2,7.4
  Route2 0.3: v12.2,7.4 13.6,8.8 24.4,8.8 24.6,9 v24.6,9.2
LED_LEFT  (via drill 0.35)
  Top 0.3: Q2.P$2 18.7,10.5 19.2,10 19.2,6.4 20.6,5 v25.6,5 | IC_1.15 31.65,7.85 v32,8.2
  Route2 0.3: v32,8.2 31.4,7.6 28.2,7.6 v25.6,5
LED_RIGHT
  Top 0.3: IC_1.38 29.65,19.65 37.1,27.1 Q3.P$2
LED_TOP
  Top 0.3: IC_1.58 12.15,11.65 11.2,12.6 11.2,13.95 Q1.P$2
N$2
  Top 0.3: C2.1 41.85,14.25 41.44,13.84 IC1.2 IC1.3
N$3
  Top 0.3: R3.1 10.7,18.3 Q1.P$3
N$4
  Top 0.3: R1.1 R2.1 40.2,11.2 IC1.4
N$5
  Top 0.3: R2.2 38.2,11.15 C1.1
N$6
  Top 0.3: Q1.P$1 8.47,15.38 J_TOP.1
N$7
  Top 0.3: R4.1 15.75,10.6 Q2.P$3
N$8
  Top 0.3: J_LEFT.1 16.62,8.12 Q2.P$1
N$10
  Top 0.3: Q3.P$3 41.46,27.21 R5.1
N$11
  Top 0.3: Q3.P$1 40.4,31.93 J_RIGHT.1
N$13
  Top 0.3: R6.1 10.4,9.65 Q4.P$3
N$14
  Top 0.3: Q4.P$1 8.47,8.38 J_FRONT.1
N$16
  Top 0.3: Q5.P$3 39.3,20.5 R7.1
N$17
  Top 0.3: Q5.P$1 43.92,23.2 J_BACK.1
NRST  (1 unrouted)
  Top 0.3: IC_1.7 27.65,5 C6.1
SS
  Top 0.24: IC3.4 8.9,28.3 C9.P$1
SW
  pour Top (no thermals): 10.4,27.4 19.3,27.4 19.3,27.8 10.4,27.8
SYS_JTCK  (via drill 0.35)
  Top 0.3: IC_1.49 24.35,16.15 v24.4,16.2 | v23.8,31.4 23.8,32.92 J1.7
  Route2 0.3: v24.4,16.2 25.7,17.5 26.8,18.6 26.8,23.8 23.8,26.8 v23.8,31.4
SYS_JTDI  (via drill 0.35)
  Top 0.3: IC_1.50 24.17,15.65 25.25,15.65 v25.4,15.8 | v25.2,31.4 25.2,32.92 J1.6
  Route2 0.3: v25.4,15.8 27.6,18 27.6,24.4 25.2,26.8 v25.2,31.4
SYS_JTDO  (via drill 0.35)
  Top 0.3: IC_1.55 24.15,13.15 v26.4,15.4 | J1.5 26.4,32.98 v26.4,31.4
  Route2 0.3: v26.4,15.4 28.4,17.4 28.4,25 26.4,27 v26.4,31.4
SYS_JTMS  (via drill 0.35)
  Top 0.3: IC_1.46 25.65,16.95 26.2,16.4 v30,16.4 | J1.3 28.8,32.92 v28.8,31.4
  Route2 0.3: v28.8,31.4 28.8,27.4 30,26.2 v30,16.4
USART1_RX
  Top 0.3: IC_1.43 27.15,20.35 30.12,23.32 J1.2
USART1_TX
  Top 0.3: IC_1.42 27.65,19.25 31.4,23 31.4,32.98 J1.1
VBAT  (via drill 0.3)
  Top 0.24: IC3.2 9.9,28 10.3,28.4 | IC3.7 8.9,23.9 v8.8,23.8
  Route2 0.3: v8.8,23.8 8.8,27 v10.6,28.8
  pour Top (no thermals): 10.2,28.3 10.2,31.6 13.4,31.6 13.4,37.6 17.4,37.6 17.4,28.3
VDD  (via drill 0.3, 0.35)
  Top 0.24: IC2.5 13.45,16.5 C5.1 v13.2,18 | IC2.8 15.25,12.9 C4.1 v16.4,12.8 | IC3.8 9.4,23.6 9.8,23.2
  Top 0.3: IC_1.13 30.65,5.95 31.2,5.4 31.2,4.85 C7.1 | C7.1 C8.1 v32.4,3.2 | C7.1 v32.4,4.8 | IC_1.19 35.8,9.65 C10.1 36.05,9.4 v37,9.4 | IC_1.32 34.95,16.15 35.45,16.65 C11.1 v36,17.6 | IC1.6 46.63,12.56 47,12.2 47.75,12.2 C3.1 v47.8,11 | v42.4,22 43.92,22 J_BACK.2 | v41.6,30.4 41.6,31.93 J_RIGHT.2 | IC_1.48 24.65,18.95 24.15,19.45 C12.1 24,20.15 v24,21.2 | v20.6,7 C13.1 21.15,8.15 21.65,8.65 IC_1.64 | J_LEFT.2 15.4,6.08 v15.4,7.8 | J_FRONT.2 7.62,9.62 v7.8,9.8 | J_TOP.2 7.62,16.62 v7.8,16.8
  other vias: 19.4,19.6 18.4,19.6 17.4,19.6
  pour Top (no thermals): 9.4,22.4 9.4,24.2 11.4,22.4 20,22.4 20,19 12.8,19
  pour Route15 (isolate 0.3): 0.4,20.2 0.4,0.4 49.6,0.4 49.6,37.6 23.2,37.6 23.2,20.2

### Text on the board
tNames: - | - | - | - | - | -